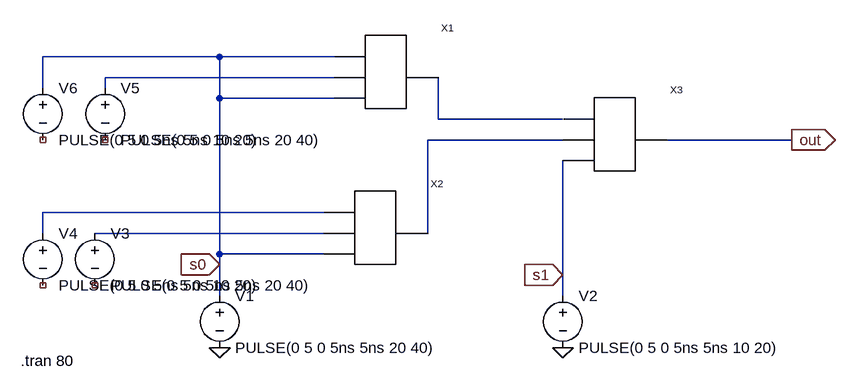
[diagram p0: schematic 4_mux.asc]
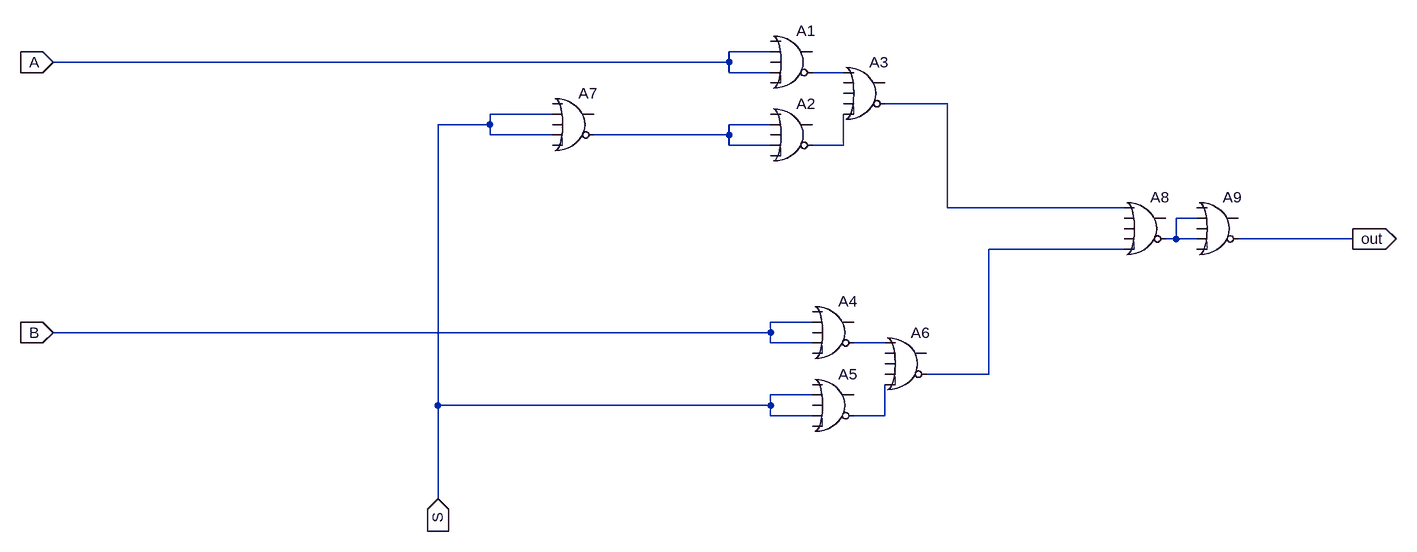
[diagram p1: sub-circuit 2_mux.asc]
* 4_mux.asc
XX1 s0 N001 s0 N002 2_mux
XX2 N004 N005 s0 N003 2_mux
XX3 N002 N003 s1 out 2_mux
V1 s0 0 PULSE(0 5 0 5ns 5ns 20 40)
V2 s1 0 PULSE(0 5 0 5ns 5ns 10 20)
V3 N005 NC_01 PULSE(0 5 0 5ns 5ns 20 40)
V4 N004 NC_02 PULSE(0 5 0 5ns 5ns 10 20)
V5 N001 NC_03 PULSE(0 5 0 5ns 5ns 20 40)
V6 s0 NC_04 PULSE(0 5 0 5ns 5ns 10 20)

* block symbol definitions
.subckt 2_mux A B S Out
A1 0 A 0 A 0 N001 0 0 OR
A2 0 N003 0 N003 0 N004 0 0 OR
A3 N001 0 0 0 N004 N002 0 0 OR
A4 0 B 0 B 0 N007 0 0 OR
A5 0 S 0 S 0 N008 0 0 OR
A6 N007 0 0 0 N008 N006 0 0 OR
A7 0 S 0 S 0 N003 0 0 OR
A8 N002 0 0 0 N006 N005 0 0 OR
A9 0 N005 0 N005 0 out 0 0 OR
.ends 2_mux

.tran 80
.backanno
.end

* Results of the author's LTspice run, read from the files saved beside the schematic
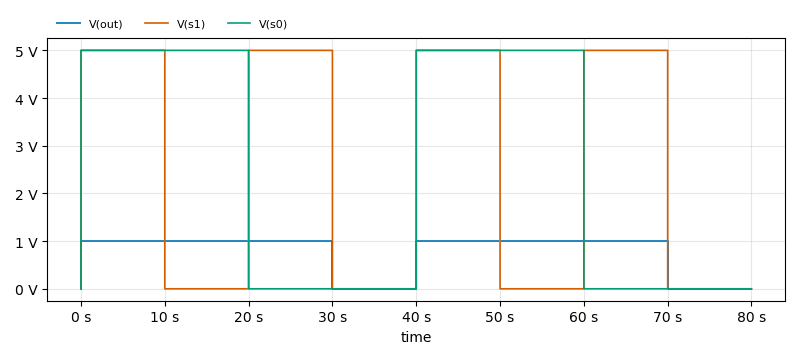
[diagram p2: Transient Analysis of 4_mux.asc, plotted from the saved traces]
* Transient Analysis, 1 run:
*   V(out): min 0 V, max 1 V, average 750 mV, rms 866 mV, last 0 V
*   V(s1): min 0 V, max 5 V, average 2.5 V, rms 3.536 V, last 0 V
*   V(s0): min 0 V, max 5 V, average 2.5 V, rms 3.536 V, last 0 V